# EAGLE schematic cape-servitron-v1 (EAGLE 6.4)

## Sheet 1 of 4
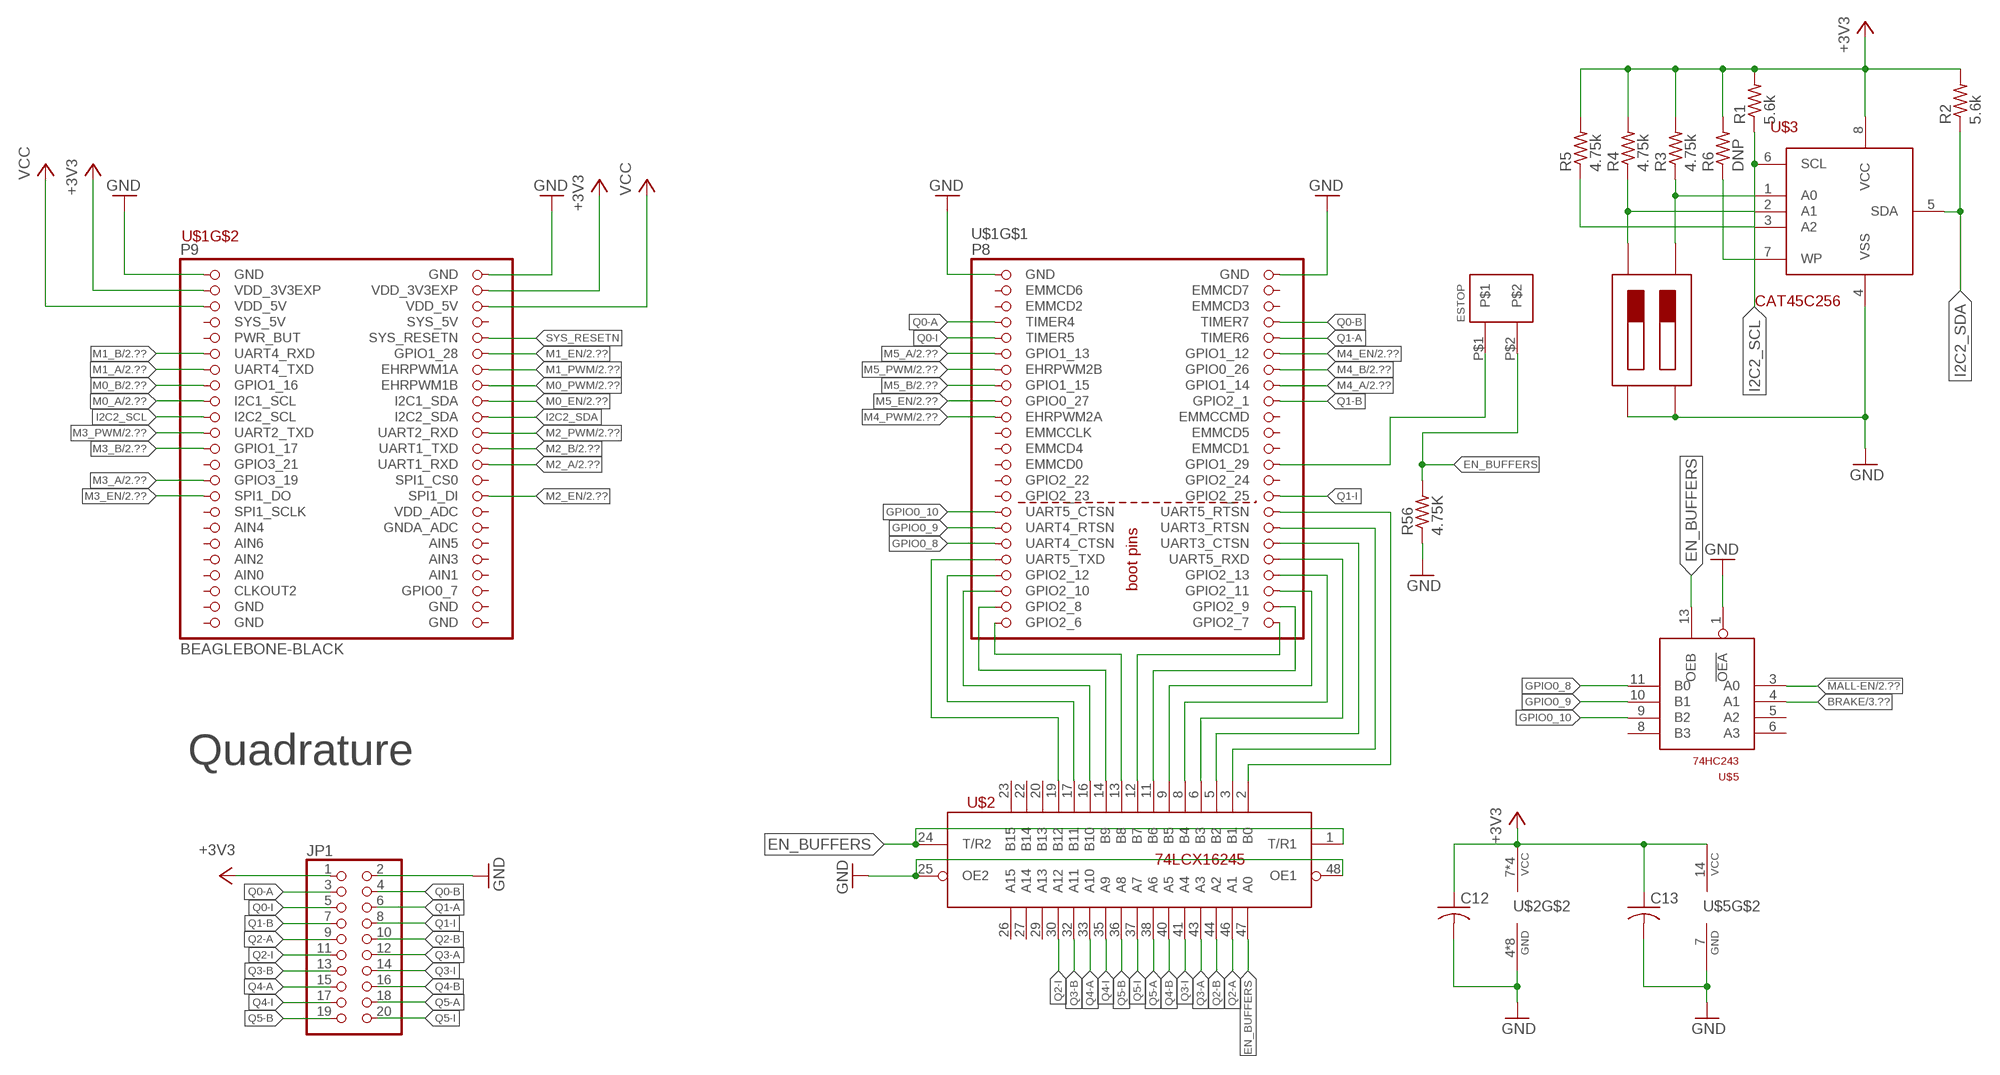
[diagram p0: schematic, sheet 1]

### Parts
C12  C-USC0805  [C0805]
C13  C-USC0805  [C0805]
ESTOP  PINHEAD-5MM-1X2  [5MM-HEADER-2]
JP1  PINHD-2X10  [2X10]
R1  5.6k  R-US_R0805  [R0805]
R2  5.6k  R-US_R0805  [R0805]
R3  4.75k  R-US_R0805  [R0805]
R4  4.75k  R-US_R0805  [R0805]
R5  4.75k  R-US_R0805  [R0805]
R6  DNP  R-US_R0805  [R0805]
R56  4.75K  R-US_R0805  [R0805]
U$1  BEAGLEBONE-BLACK  [BEAGLEBONE_SHIELD]
U$2  74LCX16245  [TSSOP-48]
U$3  CAT24C2256Y  [TSSOP-8]
U$4  DIP-SW-2  [CT219-2]
U$5  74HC243D  [SO14]

### Nets
!MALL-EN: U$5.3(A0) ; also sheet 2
+3V3: C12.1 C13.1 JP1.1 R1.2 R2.2 R3.2 R4.2 R5.2 R6.2 U$1.49(VDD_3V3EXP) U$1.50(VDD_3V3EXP) U$2.7(VCC) U$2.18(VCC) U$2.31(VCC) U$2.42(VCC) U$3.8(VCC) U$5.14(VCC) ; also sheet 3
BRAKE: U$5.4(A1) ; also sheet 3
EN_BUFFERS: ESTOP.P$2 R56.2 U$2.1(T/R1) U$2.24(T/R2) U$2.47(A0) U$5.13(OEB)
GND: C12.2 C13.2 JP1.2 R56.1 U$1.1(GND) U$1.2(GND) U$1.47(GND) U$1.48(GND) U$2.4(GND) U$2.10(GND) U$2.15(GND) U$2.21(GND) U$2.25(OE2) U$2.28(GND) U$2.34(GND) U$2.39(GND) U$2.45(GND) U$2.48(OE1) U$3.4(VSS) U$4.1 U$4.2 U$5.1(!OEA) U$5.7(GND) ; also sheet 2,3
GPIO0_8: U$1.35(UART4_CTSN) U$5.11(B0)
GPIO0_9: U$1.33(UART4_RTSN) U$5.10(B1)
GPIO0_10: U$1.31(UART5_CTSN) U$5.9(B2)
I2C2_SCL: R1.1 U$1.65(I2C2_SCL) U$3.6(SCL)
I2C2_SDA: R2.1 U$1.66(I2C2_SDA) U$3.5(SDA)
M0_A: U$1.63(I2C1_SCL) ; also sheet 2
M0_B: U$1.61(GPIO1_16) ; also sheet 2
M0_EN: U$1.64(I2C1_SDA) ; also sheet 2
M0_PWM: U$1.62(EHRPWM1B) ; also sheet 2
M1_A: U$1.59(UART4_TXD) ; also sheet 2
M1_B: U$1.57(UART4_RXD) ; also sheet 2
M1_EN: U$1.58(GPIO1_28) ; also sheet 2
M1_PWM: U$1.60(EHRPWM1A) ; also sheet 2
M2_A: U$1.72(UART1_RXD) ; also sheet 2
M2_B: U$1.70(UART1_TXD) ; also sheet 2
M2_EN: U$1.76(SPI1_DI) ; also sheet 2
M2_PWM: U$1.68(UART2_RXD) ; also sheet 2
M3_A: U$1.73(GPIO3_19) ; also sheet 2
M3_B: U$1.69(GPIO1_17) ; also sheet 2
M3_EN: U$1.75(SPI1_DO) ; also sheet 2
M3_PWM: U$1.67(UART2_TXD) ; also sheet 2
M4_A: U$1.16(GPIO1_14) ; also sheet 2
M4_B: U$1.14(GPIO0_26) ; also sheet 2
M4_EN: U$1.12(GPIO1_12) ; also sheet 2
M4_PWM: U$1.19(EHRPWM2A) ; also sheet 2
M5_A: U$1.11(GPIO1_13) ; also sheet 2
M5_B: U$1.15(GPIO1_15) ; also sheet 2
M5_EN: U$1.17(GPIO0_27) ; also sheet 2
M5_PWM: U$1.13(EHRPWM2B) ; also sheet 2
N$1: U$1.45(GPIO2_6) U$2.13(B8)
N$2: U$1.46(GPIO2_7) U$2.12(B7)
N$3: U$1.43(GPIO2_8) U$2.14(B9)
N$4: U$1.44(GPIO2_9) U$2.11(B6)
N$5: U$1.41(GPIO2_10) U$2.16(B10)
N$6: U$1.42(GPIO2_11) U$2.9(B5)
N$7: U$1.40(GPIO2_13) U$2.8(B4)
N$8: U$1.39(GPIO2_12) U$2.17(B11)
N$9: U$1.37(UART5_TXD) U$2.19(B12)
N$10: U$1.38(UART5_RXD) U$2.6(B3)
N$14: U$1.36(UART3_CTSN) U$2.5(B2)
N$15: U$1.34(UART3_RTSN) U$2.3(B1)
N$19: R3.1 U$3.1(A0) U$4.4
N$20: R4.1 U$3.2(A1) U$4.3
N$21: R5.1 U$3.3(A2)
N$23: R6.1 U$3.7(WP)
N$24: U$1.32(UART5_RTSN) U$2.2(B0)
N$25: ESTOP.P$1 U$1.26(GPIO1_29)
Q0-A: JP1.3 U$1.7(TIMER4)
Q0-B: JP1.4 U$1.8(TIMER7)
Q0-I: JP1.5 U$1.9(TIMER5)
Q1-A: JP1.6 U$1.10(TIMER6)
Q1-B: JP1.7 U$1.18(GPIO2_1)
Q1-I: JP1.8 U$1.30(GPIO2_25)
Q2-A: JP1.9 U$2.46(A1)
Q2-B: JP1.10 U$2.44(A2)
Q2-I: JP1.11 U$2.30(A12)
Q3-A: JP1.12 U$2.43(A3)
Q3-B: JP1.13 U$2.32(A11)
Q3-I: JP1.14 U$2.41(A4)
Q4-A: JP1.15 U$2.33(A10)
Q4-B: JP1.16 U$2.40(A5)
Q4-I: JP1.17 U$2.35(A9)
Q5-A: JP1.18 U$2.38(A6)
Q5-B: JP1.19 U$2.36(A8)
Q5-I: JP1.20 U$2.37(A7)
SYS_RESETN: U$1.56(SYS_RESETN)
VCC: U$1.51(VDD_5V) U$1.52(VDD_5V) ; also sheet 2,3
Unconnected: U$1.3(EMMCD6) U$1.4(EMMCD7) U$1.5(EMMCD2) U$1.6(EMMCD3) U$1.20(EMMCCMD) U$1.21(EMMCCLK) U$1.22(EMMCD5) U$1.23(EMMCD4) U$1.24(EMMCD1) U$1.25(EMMCD0) U$1.27(GPIO2_22) U$1.28(GPIO2_24) U$1.29(GPIO2_23) U$1.53(SYS_5V) U$1.54(SYS_5V) U$1.55(PWR_BUT) U$1.71(GPIO3_21) U$1.74(SPI1_CS0) U$1.77(SPI1_SCLK) U$1.78(VDD_ADC) U$1.79(AIN4) U$1.80(GNDA_ADC) U$1.81(AIN6) U$1.82(AIN5) U$1.83(AIN2) U$1.84(AIN3) U$1.85(AIN0) U$1.86(AIN1) U$1.87(CLKOUT2) U$1.88(GPIO0_7) U$2.20(B13) U$2.22(B14) U$2.23(B15) U$2.26(A15) U$2.27(A14) U$2.29(A13) U$5.5(A2) U$5.6(A3) U$5.8(B3)

### Notes on the sheet
- Quadrature

## Sheet 2 of 4
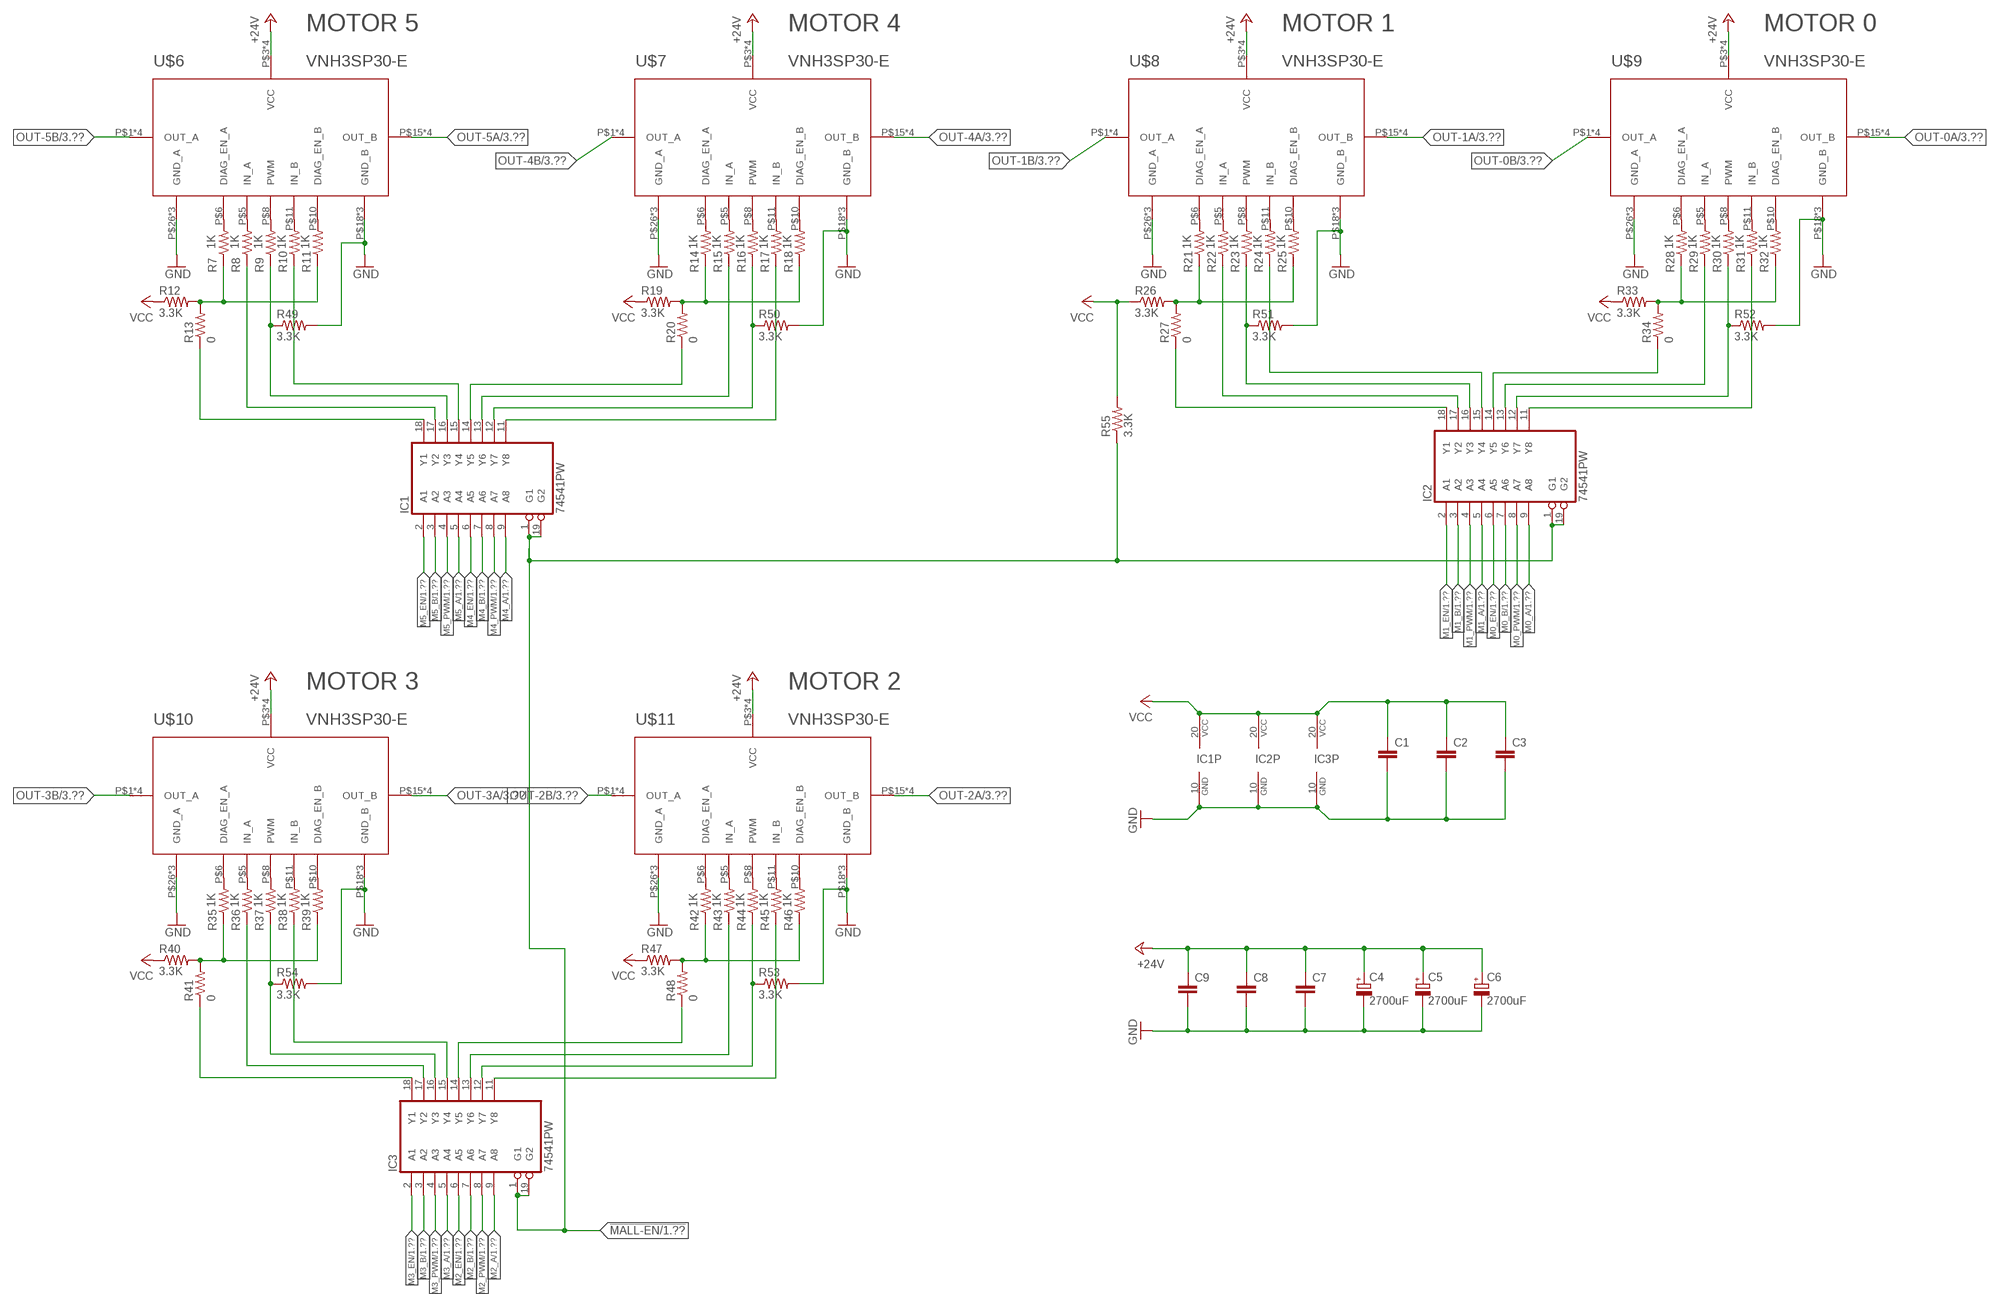
[diagram p1: schematic, sheet 2]

### Parts
C1  C-EUC1206  [C1206]
C2  C-EUC1206  [C1206]
C3  C-EUC1206  [C1206]
C4  2700uF  CPOL-EUE5-13  [E5-13]
C5  2700uF  CPOL-EUE5-13  [E5-13]
C6  2700uF  CPOL-EUE5-13  [E5-13]
C7  C-EUC1206  [C1206]
C8  C-EUC1206  [C1206]
C9  C-EUC1206  [C1206]
IC1  74541PW  [TSSOP-20]
IC2  74541PW  [TSSOP-20]
IC3  74541PW  [TSSOP-20]
R7  1K  R-US_R0805  [R0805]
R8  1K  R-US_R0805  [R0805]
R9  1K  R-US_R0805  [R0805]
R10  1K  R-US_R0805  [R0805]
R11  1K  R-US_R0805  [R0805]
R12  3.3K  R-US_R0805  [R0805]
R13  0  R-US_R0805  [R0805]
R14  1K  R-US_R0805  [R0805]
R15  1K  R-US_R0805  [R0805]
R16  1K  R-US_R0805  [R0805]
R17  1K  R-US_R0805  [R0805]
R18  1K  R-US_R0805  [R0805]
R19  3.3K  R-US_R0805  [R0805]
R20  0  R-US_R0805  [R0805]
R21  1K  R-US_R0805  [R0805]
R22  1K  R-US_R0805  [R0805]
R23  1K  R-US_R0805  [R0805]
R24  1K  R-US_R0805  [R0805]
R25  1K  R-US_R0805  [R0805]
R26  3.3K  R-US_R0805  [R0805]
R27  0  R-US_R0805  [R0805]
R28  1K  R-US_R0805  [R0805]
R29  1K  R-US_R0805  [R0805]
R30  1K  R-US_R0805  [R0805]
R31  1K  R-US_R0805  [R0805]
R32  1K  R-US_R0805  [R0805]
R33  3.3K  R-US_R0805  [R0805]
R34  0  R-US_R0805  [R0805]
R35  1K  R-US_R0805  [R0805]
R36  1K  R-US_R0805  [R0805]
R37  1K  R-US_R0805  [R0805]
R38  1K  R-US_R0805  [R0805]
R39  1K  R-US_R0805  [R0805]
R40  3.3K  R-US_R0805  [R0805]
R41  0  R-US_R0805  [R0805]
R42  1K  R-US_R0805  [R0805]
R43  1K  R-US_R0805  [R0805]
R44  1K  R-US_R0805  [R0805]
R45  1K  R-US_R0805  [R0805]
R46  1K  R-US_R0805  [R0805]
R47  3.3K  R-US_R0805  [R0805]
R48  0  R-US_R0805  [R0805]
R49  3.3K  R-US_R0805  [R0805]
R50  3.3K  R-US_R0805  [R0805]
R51  3.3K  R-US_R0805  [R0805]
R52  3.3K  R-US_R0805  [R0805]
R53  3.3K  R-US_R0805  [R0805]
R54  3.3K  R-US_R0805  [R0805]
R55  3.3K  R-US_R0805  [R0805]
U$6  VNH3SP30-E  [MULTIPOWER-SO-30]
U$7  VNH3SP30-E  [MULTIPOWER-SO-30]
U$8  VNH3SP30-E  [MULTIPOWER-SO-30]
U$9  VNH3SP30-E  [MULTIPOWER-SO-30]
U$10  VNH3SP30-E  [MULTIPOWER-SO-30]
U$11  VNH3SP30-E  [MULTIPOWER-SO-30]

### Nets
!MALL-EN: IC1.1(G1) IC1.19(G2) IC2.1(G1) IC2.19(G2) IC3.1(G1) IC3.19(G2) R55.1 ; also sheet 1
+24V: C4.+ C5.+ C6.+ C7.1 C8.1 C9.1 U$6.P$3(VCC) U$6.P$13(VCC) U$6.P$23(VCC) U$6.T$3(VCC) U$7.P$3(VCC) U$7.P$13(VCC) U$7.P$23(VCC) U$7.T$3(VCC) U$8.P$3(VCC) U$8.P$13(VCC) U$8.P$23(VCC) U$8.T$3(VCC) U$9.P$3(VCC) U$9.P$13(VCC) U$9.P$23(VCC) U$9.T$3(VCC) U$10.P$3(VCC) U$10.P$13(VCC) U$10.P$23(VCC) U$10.T$3(VCC) U$11.P$3(VCC) U$11.P$13(VCC) U$11.P$23(VCC) U$11.T$3(VCC) ; also sheet 3
GND: C1.2 C2.2 C3.2 C4.- C5.- C6.- C7.2 C8.2 C9.2 IC1.10(GND) IC2.10(GND) IC3.10(GND) R49.2 R50.2 R51.2 R52.2 R53.2 R54.2 U$6.P$18(GND_B) U$6.P$19(GND_B) U$6.P$20(GND_B) U$6.P$26(GND_A) U$6.P$27(GND_A) U$6.P$28(GND_A) U$7.P$18(GND_B) U$7.P$19(GND_B) U$7.P$20(GND_B) U$7.P$26(GND_A) U$7.P$27(GND_A) U$7.P$28(GND_A) U$8.P$18(GND_B) U$8.P$19(GND_B) U$8.P$20(GND_B) U$8.P$26(GND_A) U$8.P$27(GND_A) U$8.P$28(GND_A) U$9.P$18(GND_B) U$9.P$19(GND_B) U$9.P$20(GND_B) U$9.P$26(GND_A) U$9.P$27(GND_A) U$9.P$28(GND_A) U$10.P$18(GND_B) U$10.P$19(GND_B) U$10.P$20(GND_B) U$10.P$26(GND_A) U$10.P$27(GND_A) U$10.P$28(GND_A) U$11.P$18(GND_B) U$11.P$19(GND_B) U$11.P$20(GND_B) U$11.P$26(GND_A) U$11.P$27(GND_A) U$11.P$28(GND_A) ; also sheet 1,3
M0_A: IC2.9(A8) ; also sheet 1
M0_B: IC2.7(A6) ; also sheet 1
M0_EN: IC2.6(A5) ; also sheet 1
M0_PWM: IC2.8(A7) ; also sheet 1
M1_A: IC2.5(A4) ; also sheet 1
M1_B: IC2.3(A2) ; also sheet 1
M1_EN: IC2.2(A1) ; also sheet 1
M1_PWM: IC2.4(A3) ; also sheet 1
M2_A: IC3.9(A8) ; also sheet 1
M2_B: IC3.7(A6) ; also sheet 1
M2_EN: IC3.6(A5) ; also sheet 1
M2_PWM: IC3.8(A7) ; also sheet 1
M3_A: IC3.5(A4) ; also sheet 1
M3_B: IC3.3(A2) ; also sheet 1
M3_EN: IC3.2(A1) ; also sheet 1
M3_PWM: IC3.4(A3) ; also sheet 1
M4_A: IC1.9(A8) ; also sheet 1
M4_B: IC1.7(A6) ; also sheet 1
M4_EN: IC1.6(A5) ; also sheet 1
M4_PWM: IC1.8(A7) ; also sheet 1
M5_A: IC1.5(A4) ; also sheet 1
M5_B: IC1.3(A2) ; also sheet 1
M5_EN: IC1.2(A1) ; also sheet 1
M5_PWM: IC1.4(A3) ; also sheet 1
N$11: R7.2 U$6.P$6(DIAG_EN_A)
N$12: R7.1 R11.1 R12.2 R13.2
N$13: IC1.18(Y1) R13.1
N$16: IC1.17(Y2) R8.1
N$17: IC1.16(Y3) R9.1 R49.1
N$18: IC1.15(Y4) R10.1
N$22: R8.2 U$6.P$5(IN_A)
N$36: R9.2 U$6.P$8(PWM)
N$37: R10.2 U$6.P$11(IN_B)
N$38: R11.2 U$6.P$10(DIAG_EN_B)
N$39: R14.2 U$7.P$6(DIAG_EN_A)
N$40: R14.1 R18.1 R19.2 R20.2
N$41: IC1.11(Y8) R17.1
N$42: IC1.12(Y7) R16.1 R50.1
N$43: IC1.13(Y6) R15.1
N$44: IC1.14(Y5) R20.1
N$45: R21.2 U$8.P$6(DIAG_EN_A)
N$46: R21.1 R25.1 R26.2 R27.2
N$47: IC2.18(Y1) R27.1
N$48: IC2.17(Y2) R22.1
N$49: IC2.16(Y3) R23.1 R51.1
N$50: IC2.15(Y4) R24.1
N$51: R22.2 U$8.P$5(IN_A)
N$52: R23.2 U$8.P$8(PWM)
N$53: R24.2 U$8.P$11(IN_B)
N$54: R25.2 U$8.P$10(DIAG_EN_B)
N$55: R28.2 U$9.P$6(DIAG_EN_A)
N$56: R28.1 R32.1 R33.2 R34.2
N$57: IC2.11(Y8) R31.1
N$58: IC2.12(Y7) R30.1 R52.1
N$59: IC2.13(Y6) R29.1
N$60: IC2.14(Y5) R34.1
N$61: R35.2 U$10.P$6(DIAG_EN_A)
N$62: R35.1 R39.1 R40.2 R41.2
N$63: IC3.18(Y1) R41.1
N$64: IC3.11(Y8) R45.1
N$65: IC3.17(Y2) R36.1
N$66: IC3.16(Y3) R37.1 R54.1
N$67: R36.2 U$10.P$5(IN_A)
N$68: R37.2 U$10.P$8(PWM)
N$69: R38.2 U$10.P$11(IN_B)
N$70: R39.2 U$10.P$10(DIAG_EN_B)
N$71: R42.2 U$11.P$6(DIAG_EN_A)
N$72: R42.1 R46.1 R47.2 R48.2
N$73: IC3.15(Y4) R38.1
N$74: IC3.12(Y7) R44.1 R53.1
N$75: IC3.13(Y6) R43.1
N$76: IC3.14(Y5) R48.1
N$77: R45.2 U$11.P$11(IN_B)
N$78: R44.2 U$11.P$8(PWM)
N$79: R43.2 U$11.P$5(IN_A)
N$80: R46.2 U$11.P$10(DIAG_EN_B)
N$81: R18.2 U$7.P$10(DIAG_EN_B)
N$82: R17.2 U$7.P$11(IN_B)
N$83: R16.2 U$7.P$8(PWM)
N$84: R15.2 U$7.P$5(IN_A)
N$85: R32.2 U$9.P$10(DIAG_EN_B)
N$86: R31.2 U$9.P$11(IN_B)
N$87: R30.2 U$9.P$8(PWM)
N$88: R29.2 U$9.P$5(IN_A)
OUT-0A [Motor]: U$9.P$15(OUT_B) U$9.P$16(OUT_B) U$9.P$21(OUT_B) U$9.T$2(OUT_B) ; also sheet 3
OUT-0B [Motor]: U$9.P$1(OUT_A) U$9.P$25(OUT_A) U$9.P$30(OUT_A) U$9.T$1(OUT_A) ; also sheet 3
OUT-1A [Motor]: U$8.P$15(OUT_B) U$8.P$16(OUT_B) U$8.P$21(OUT_B) U$8.T$2(OUT_B) ; also sheet 3
OUT-1B [Motor]: U$8.P$1(OUT_A) U$8.P$25(OUT_A) U$8.P$30(OUT_A) U$8.T$1(OUT_A) ; also sheet 3
OUT-2A [Motor]: U$11.P$15(OUT_B) U$11.P$16(OUT_B) U$11.P$21(OUT_B) U$11.T$2(OUT_B) ; also sheet 3
OUT-2B [Motor]: U$11.P$1(OUT_A) U$11.P$25(OUT_A) U$11.P$30(OUT_A) U$11.T$1(OUT_A) ; also sheet 3
OUT-3A [Motor]: U$10.P$15(OUT_B) U$10.P$16(OUT_B) U$10.P$21(OUT_B) U$10.T$2(OUT_B) ; also sheet 3
OUT-3B [Motor]: U$10.P$1(OUT_A) U$10.P$25(OUT_A) U$10.P$30(OUT_A) U$10.T$1(OUT_A) ; also sheet 3
OUT-4A [Motor]: U$7.P$15(OUT_B) U$7.P$16(OUT_B) U$7.P$21(OUT_B) U$7.T$2(OUT_B) ; also sheet 3
OUT-4B [Motor]: U$7.P$1(OUT_A) U$7.P$25(OUT_A) U$7.P$30(OUT_A) U$7.T$1(OUT_A) ; also sheet 3
OUT-5A [Motor]: U$6.P$15(OUT_B) U$6.P$16(OUT_B) U$6.P$21(OUT_B) U$6.T$2(OUT_B) ; also sheet 3
OUT-5B [Motor]: U$6.P$1(OUT_A) U$6.P$25(OUT_A) U$6.P$30(OUT_A) U$6.T$1(OUT_A) ; also sheet 3
VCC: C1.1 C2.1 C3.1 IC1.20(VCC) IC2.20(VCC) IC3.20(VCC) R12.1 R19.1 R26.1 R33.1 R40.1 R47.1 R55.2 ; also sheet 1,3

### Notes on the sheet
- MOTOR 5 | MOTOR 4 | MOTOR 1 | MOTOR 0
- MOTOR 3 | MOTOR 2

## Sheet 3 of 4
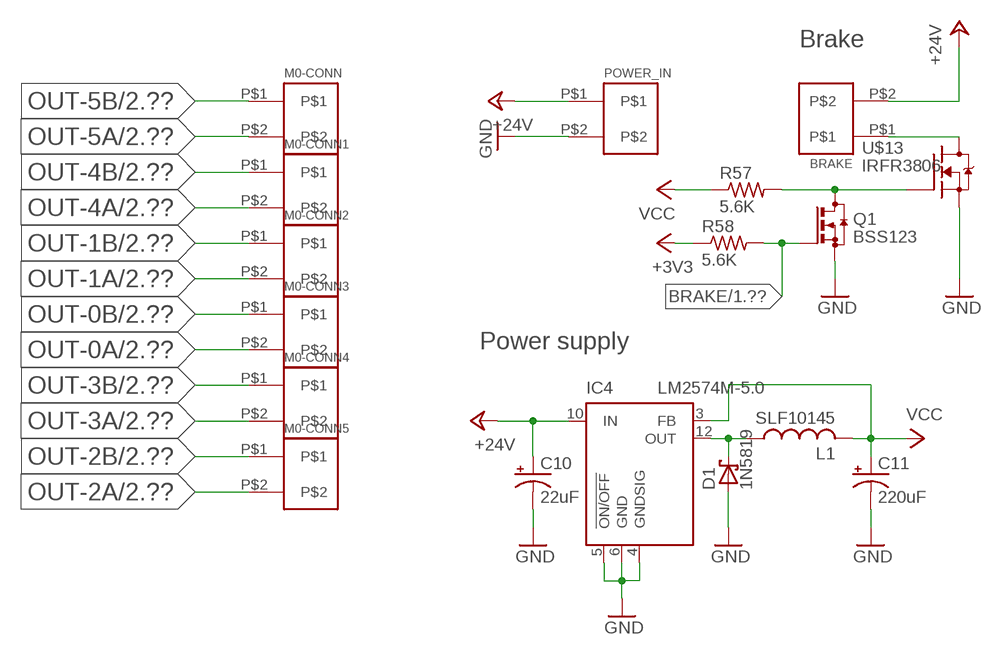
[diagram p2: schematic, sheet 3]

### Parts
BRAKE  PINHEAD-5MM-1X2  [5MM-HEADER-2]
C10  22uF  CPOL-USSANYO_SMD_E7  [SANYO-OSCON_SMD_E7]
C11  220uF  CPOL-USSANYO_SMD_F8  [SANYO-OSCON_SMD_F8]
D1  1N5819  [SOD-123]
IC4  LM2574M-5.0  [SO14W]
L1  SLF10145  [SMD10145]
M0-CONN  PINHEAD-5MM-1X2  [5MM-HEADER-2]
M0-CONN1  PINHEAD-5MM-1X2  [5MM-HEADER-2]
M0-CONN2  PINHEAD-5MM-1X2  [5MM-HEADER-2]
M0-CONN3  PINHEAD-5MM-1X2  [5MM-HEADER-2]
M0-CONN4  PINHEAD-5MM-1X2  [5MM-HEADER-2]
M0-CONN5  PINHEAD-5MM-1X2  [5MM-HEADER-2]
POWER_IN  PINHEAD-5MM-1X2  [5MM-HEADER-2]
Q1  BSS123  [SOT23]
R57  5.6K  R-US_R0805  [R0805]
R58  5.6K  R-US_R0805  [R0805]
U$13  IRFR3806  [TO252]

### Nets
+3V3: R58.1 ; also sheet 1
+24V: BRAKE.P$2 C10.+ IC4.10(IN) POWER_IN.P$1 ; also sheet 2
BRAKE: Q1.1(G) R58.2 ; also sheet 1
GND: C10.- C11.- D1.A IC4.4(GNDSIG) IC4.5(!ON/OFF) IC4.6(GND) POWER_IN.P$2 Q1.2(S) U$13.2(S) ; also sheet 1,2
N$26: D1.C IC4.12(OUT) L1.P$1
N$27 [Motor]: BRAKE.P$1 U$13.3(D)
N$28: Q1.3(D) R57.2 U$13.1(G)
OUT-0A [Motor]: M0-CONN3.P$2 ; also sheet 2
OUT-0B [Motor]: M0-CONN3.P$1 ; also sheet 2
OUT-1A [Motor]: M0-CONN2.P$2 ; also sheet 2
OUT-1B [Motor]: M0-CONN2.P$1 ; also sheet 2
OUT-2A [Motor]: M0-CONN5.P$2 ; also sheet 2
OUT-2B [Motor]: M0-CONN5.P$1 ; also sheet 2
OUT-3A [Motor]: M0-CONN4.P$2 ; also sheet 2
OUT-3B [Motor]: M0-CONN4.P$1 ; also sheet 2
OUT-4A [Motor]: M0-CONN1.P$2 ; also sheet 2
OUT-4B [Motor]: M0-CONN1.P$1 ; also sheet 2
OUT-5A [Motor]: M0-CONN.P$2 ; also sheet 2
OUT-5B [Motor]: M0-CONN.P$1 ; also sheet 2
VCC: C11.+ IC4.3(FB) L1.P$2 R57.1 ; also sheet 1,2

### Notes on the sheet
- Brake
- Power supply

## Sheet 4 of 4
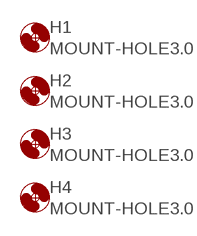
[diagram p3: schematic, sheet 4]

### Parts
H1  MOUNT-HOLE3.0  [3,0]
H2  MOUNT-HOLE3.0  [3,0]
H3  MOUNT-HOLE3.0  [3,0]
H4  MOUNT-HOLE3.0  [3,0]

## Power pins joined to a net without a drawn wire
GND: U$1.89(GND) U$1.90(GND) U$1.91(GND) U$1.92(GND)

## Library data of the parts
BRAKE M0-CONN M0-CONN1-M0-CONN5 POWER_IN = controller:PINHEAD-5MM-1X2
C1-C3 C7-C9 = rcl:C-EU: CAPACITOR, European symbol
C4-C6 = rcl:CPOL-EU: POLARIZED CAPACITOR, European symbol
C10 C11 = rcl:CPOL-US: POLARIZED CAPACITOR, American symbol
C12 C13 = rcl:C-US: CAPACITOR, American symbol
D1 = typewriter-project:1N5819
ESTOP = parts:PINHEAD-5MM-1X2
H1-H4 = holes:MOUNT-HOLE: MOUNTING HOLE with drill center marker
IC1-IC3 = parts:74*541: Octal BUFFER and LINE DRIVER, 3-state
IC4 = linear:LM2574?-*: SIMPLE SWITCHER 0.5A Step-Down Voltage Regulator Source: http://cache.national.com/ds/LM/LM2574.pdf
JP1 = pinhead:PINHD-2X10: PIN HEADER
L1 = typewriter-project:SLF10145
Q1 = transistor-small-signal:BSS123: N-CHANNEL MOS FET
R1-R58 = rcl:R-US_: RESISTOR, American symbol
U$1 = parts:BEAGLEBONE-BLACK
U$2 = parts:74LCX16245: Low Voltage 16-bit Bidirection Transceiver. 3.3V device with 5V tolerant I/O.
U$3 = parts:CAT24C2256: 256kb Serial CMOS EEPROM, I2C
U$4 = parts:DIP-SW-2
U$5 = parts:74HC243
U$6-U$11 = controller:VNH3SP30
U$13 = controller:IRF?3806

## Net classes
1 Motor: width 0.5 mm, clearance 0.3 mm